# Altium schematic sheet MultiChannelFlex.SchDoc
size A; SheetNumber: 1; SheetTotal: 2
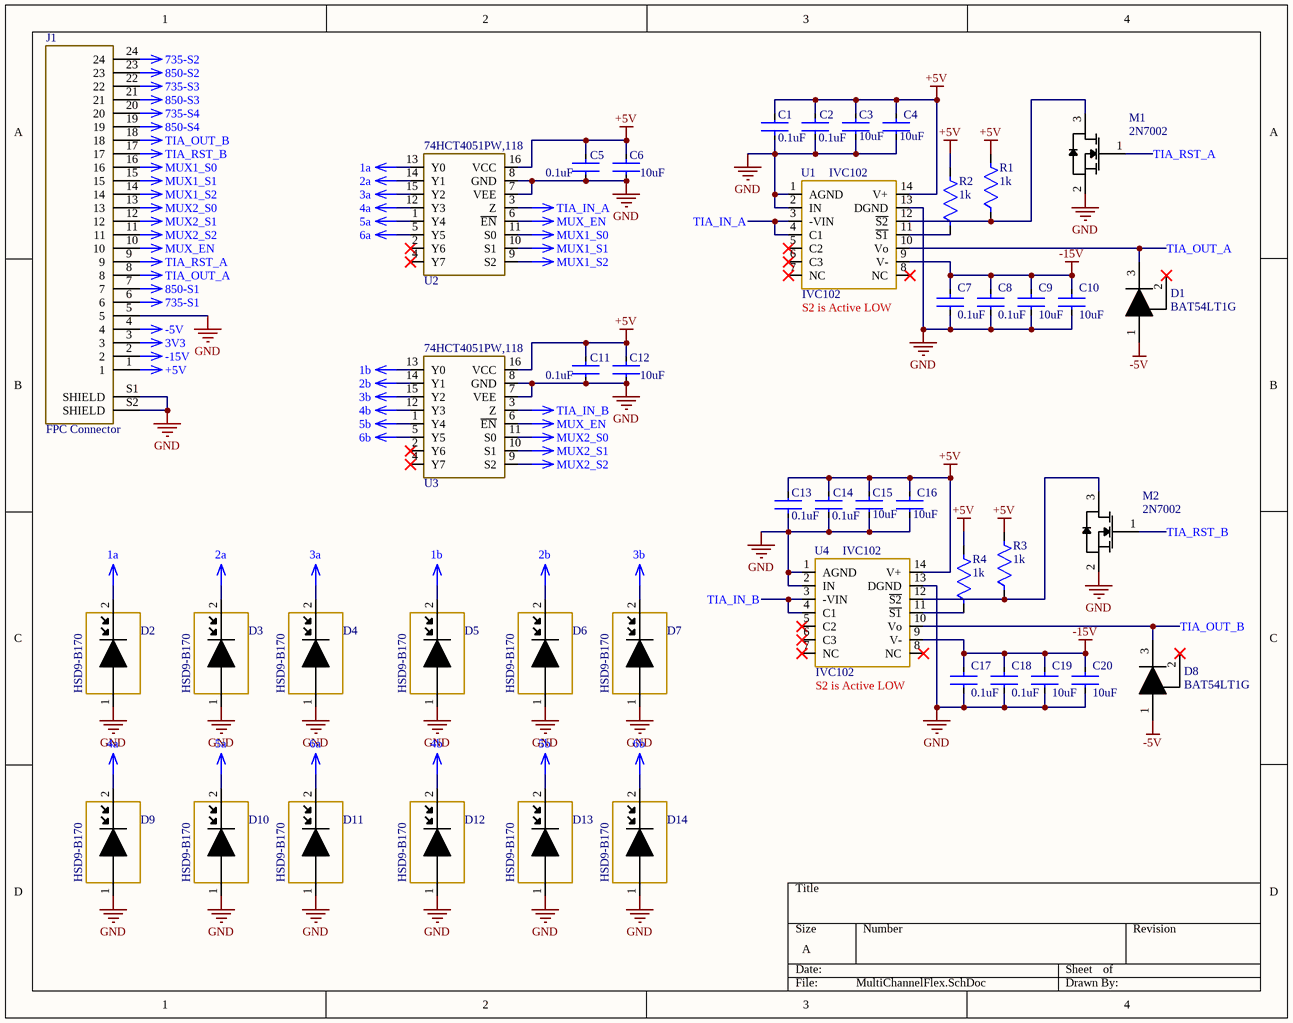
[diagram p0: MultiChannelFlex.SchDoc]

## Parts
C1  0.1uF  [CAPC3216X180N]
C2  0.1uF  [CAPC3216X180N]
C3  10uF  [CAPC3216X180N]
C4  10uF  [CAPC3216X180N]
C5  0.1uF  [CAPC3216X180N]
C6  10uF  [CAPC3216X180N]
C7  0.1uF  [CAPC3216X180N]
C8  0.1uF  [CAPC3216X180N]
C9  10uF  [CAPC3216X180N]
C10  10uF  [CAPC3216X180N]
C11  0.1uF  [CAPC3216X180N]
C12  10uF  [CAPC3216X180N]
C13  0.1uF  [CAPC3216X180N]
C14  0.1uF  [CAPC3216X180N]
C15  10uF  [CAPC3216X180N]
C16  10uF  [CAPC3216X180N]
C17  0.1uF  [CAPC3216X180N]
C18  0.1uF  [CAPC3216X180N]
C19  10uF  [CAPC3216X180N]
C20  10uF  [CAPC3216X180N]
D1  BAT54LT1G  [BAT54LT1]
D2  HSD9-B170  [HSD9-B170]  (value not drawn)
D3  HSD9-B170  [HSD9-B170]  (value not drawn)
D4  HSD9-B170  [HSD9-B170]  (value not drawn)
D5  HSD9-B170  [HSD9-B170]  (value not drawn)
D6  HSD9-B170  [HSD9-B170]  (value not drawn)
D7  HSD9-B170  [HSD9-B170]  (value not drawn)
D8  BAT54LT1G  [BAT54LT1]
D9  HSD9-B170  [HSD9-B170]  (value not drawn)
D10  HSD9-B170  [HSD9-B170]  (value not drawn)
D11  HSD9-B170  [HSD9-B170]  (value not drawn)
D12  HSD9-B170  [HSD9-B170]  (value not drawn)
D13  HSD9-B170  [HSD9-B170]  (value not drawn)
D14  HSD9-B170  [HSD9-B170]  (value not drawn)
J1  FPC Connector  [TE_FPC]
M1  2N7002  [STM-SOT-23-3_V]
M2  2N7002  [STM-SOT-23-3_V]
R1  1k  [R1206]
R2  1k  [R1206]
R3  1k  [R1206]
R4  1k  [R1206]
U1  IVC102  [D0014A_M]
U2  8x1 Analog MUX TSSOP16  [TSSOP-16]  (value not drawn)
U3  8x1 Analog MUX TSSOP16  [TSSOP-16]  (value not drawn)
U4  IVC102  [D0014A_M]

## Nets
1a: D2.2 U2.13(Y0)
1b: D5.2 U3.13(Y0)
2a: D3.2 U2.14(Y1)
2b: D6.2 U3.14(Y1)
3a: D4.2 U2.15(Y2)
3b: D7.2 U3.15(Y2)
3V3: J1.3
4a: D9.2 U2.12(Y3)
4b: D12.2 U3.12(Y3)
5a: D10.2 U2.1(Y4)
5b: D13.2 U3.1(Y4)
6a: D11.2 U2.5(Y5)
6b: D14.2 U3.5(Y5)
735-S1: J1.6
735-S2: J1.24
735-S3: J1.22
735-S4: J1.20
850-S1: J1.7
850-S2: J1.23
850-S3: J1.21
850-S4: J1.19
+5V: C1.2 C2.1 C3.1 C4.1 C5.1 C6.1 C11.1 C12.1 C13.2 C14.1 C15.1 C16.1 J1.1 R1.2 R2.2 R3.2 R4.2 U1.14(V+) U2.16(VCC) U3.16(VCC) U4.14(V+)
-5V: D1.1(A) D8.1(A) J1.4
-15V: C7.1 C8.1 C9.1 C10.1 C17.1 C18.1 C19.1 C20.1 J1.2 U1.9(V-) U4.9(V-)
GND: C1.1 C2.2 C3.2 C4.2 C5.2 C6.2 C7.2 C8.2 C9.2 C10.2 C11.2 C12.2 C13.1 C14.2 C15.2 C16.2 C17.2 C18.2 C19.2 C20.2 D2.1 D3.1 D4.1 D5.1 D6.1 D7.1 D9.1 D10.1 D11.1 D12.1 D13.1 D14.1 J1.5 J1.S1(SHIELD) J1.S2(SHIELD) M1.2(S) M2.2(S) U1.1(AGND) U1.2(IN) U1.13(DGND) U2.7(VEE) U2.8(GND) U3.7(VEE) U3.8(GND) U4.1(AGND) U4.2(IN) U4.13(DGND)
MUX1_S0: J1.16 U2.11(S0)
MUX1_S1: J1.15 U2.10(S1)
MUX1_S2: J1.14 U2.9(S2)
MUX2_S0: J1.13 U3.11(S0)
MUX2_S1: J1.12 U3.10(S1)
MUX2_S2: J1.11 U3.9(S2)
MUX_EN: J1.10 U2.6(~{EN}) U3.6(~{EN})
TIA_IN_A: U1.3(-VIN) U1.4(C1) U2.3(Z)
TIA_IN_B: U3.3(Z) U4.3(-VIN) U4.4(C1)
TIA_OUT_A: D1.3(K) J1.8 U1.10(Vo)
TIA_OUT_B: D8.3(K) J1.18 U4.10(Vo)
TIA_RST_A: J1.9 M1.1(G)
TIA_RST_B: J1.17 M2.1(G)
NetM1_3: M1.3(D) R1.1 U1.12(~{S2})
NetM2_3: M2.3(D) R3.1 U4.12(~{S2})
NetR2_1: R2.1 U1.11(~{S1})
NetR4_1: R4.1 U4.11(~{S1})

Not connected (* = marked no-connect by the designer): D1 2(NC)*; D8 2(NC)*; U1 5(C2)* 6(C3)* 7(NC)* 8(NC)*; U2 2(Y6)* 4(Y7)*; U3 2(Y6)* 4(Y7)*; U4 5(C2)* 6(C3)* 7(NC)* 8(NC)*

## Notes on the sheet
- (near U1) S2 is Active LOW
- (near U4) S2 is Active LOW
- (in symbol 74HCT4051PW) 74HCT4051PW,118

## Library data of the parts
C1 C2 C5 C7 C8 C11 C13 C14 C17 C18 = C1206C104K5RAC7210: 1206; Manufacturer: KEMET; Tolerance: 0.1; Material: Ceramic; Voltage Rating: 50 V; Temperature Characteristic: X7R; Automotive Grade: Grade 0; Capacitance: 0.10 μF; Value: 0.10 μF; Temperature Coefficient: 15%; Device Class L3: Ceramic Capacitors; ComponentLink2URL: https://content.kemet.com/datasheets/KEM_C1007_X8R_ULTRA_150C_SMD.pdf; Temperature Range Low: -55°C; RoHS: TRUE; Temperature Range High: +150°C; Automotive: Yes; Height: 0.88mm; Manufacturer Part Number: C1206C104K5RAC7210; Temperature: -55°C to +150°C; Octopart: https://octopart.com/c1206c104k5rac7210-kemet-3919856; Package: C1206C-EB; Mouser Description: Multilayer Ceramic Capacitors MLCC - SMD/SMT 50volts 0.1uF X7R 10%; Ipc Land Pattern Name: CAPC320160X78; Device Class L2: Capacitors; Category: Cap; Lead Free: Yes; ComponentLink2Description: Datasheet; Digikey Description: CAP CER 0.1UF 50V X7R 1206; Device Class L1: Passive Components
C3 C4 C6 C9 C10 C12 C15 C16 C19 C20 = CL31B106KOHNNWE: 1206
D1 D8 = BAT54L: Schottky Barrier Diode, 3-Pin SOT-23, Pb-Free, Tape and Reel; Manufacturer: On Semiconductor; IFSM Max (A): 0.6; Configuration: Single; trr Max (ns): 5; PackageVersion: Rev. AP, 11/2009; ComponentLink3Description: Package Specification; RoHS: TRUE; ComponentLink3URL: http://www.onsemi.cn/pub_link/Collateral/318-08.PDF; PackageDescription: 3-Pin Small Outline Transistor, Body 2.92 x 1.3 mm, Pitch 0.95 mm; DatasheetVersion: Rev. 12; ComponentLink1Description: Manufacturer URL; PartNumber: BAT54LT1G; ComponentLink2Description: Datasheet; Mounting Technology: Surface Mount; PackageReference: SOT-23-3-318-08; ComponentLink2URL: http://www.onsemi.cn/pub_link/Collateral/BAT54LT1-D.PDF; ComponentLink1URL: http://www.onsemi.com/; Packing: Tape and Reel
J1 = 2-1734592-4: 24 Position FPC Connector Contacts, Bottom 0.020" _0.50mm_ Surface Mount, Right Angle; MF: TE Connectivity; MP: 2-1734592-4; Value: *; Package: None; Price: None; SnapEDA_Link: https://www.snapeda.com/parts/2-1734592-4/TE%20Connectivity/view-part/4788511/?ref=snap; Availability: Unavailable
M1 M2 = 2N7002-TP: N-channel 60 V, 1.8 Ohm, 0.35 A STripFET(TM) II Power MOSFET, SOT23; Manufacturer: STMicroelectronics; PartNumber: 2N7002; ComponentLink2Description: Datasheet; ComponentLink2URL: http://www.st.com/st-web-ui/static/active/en/resource/technical/document/datasheet/CD00005134.pdf; ComponentLink1Description: Manufacturer URL; ComponentLink1URL: http://www.st.com/; DatasheetVersion: Rev. 9, 11/2008; PackageReference: SOT-23; Mounting Technology: Surface Mount; PackageDescription: 3-Pin SOT23, 3.016 x 2.8 mm Body, 0.95 mm Pitch
R1-R4 = RT1206BRD071KL: 1206 1kOhm
U2 U3 = 74HCT4051PW